# EAGLE design wt41_uart_breakout_board_v10 (EAGLE 5.11)
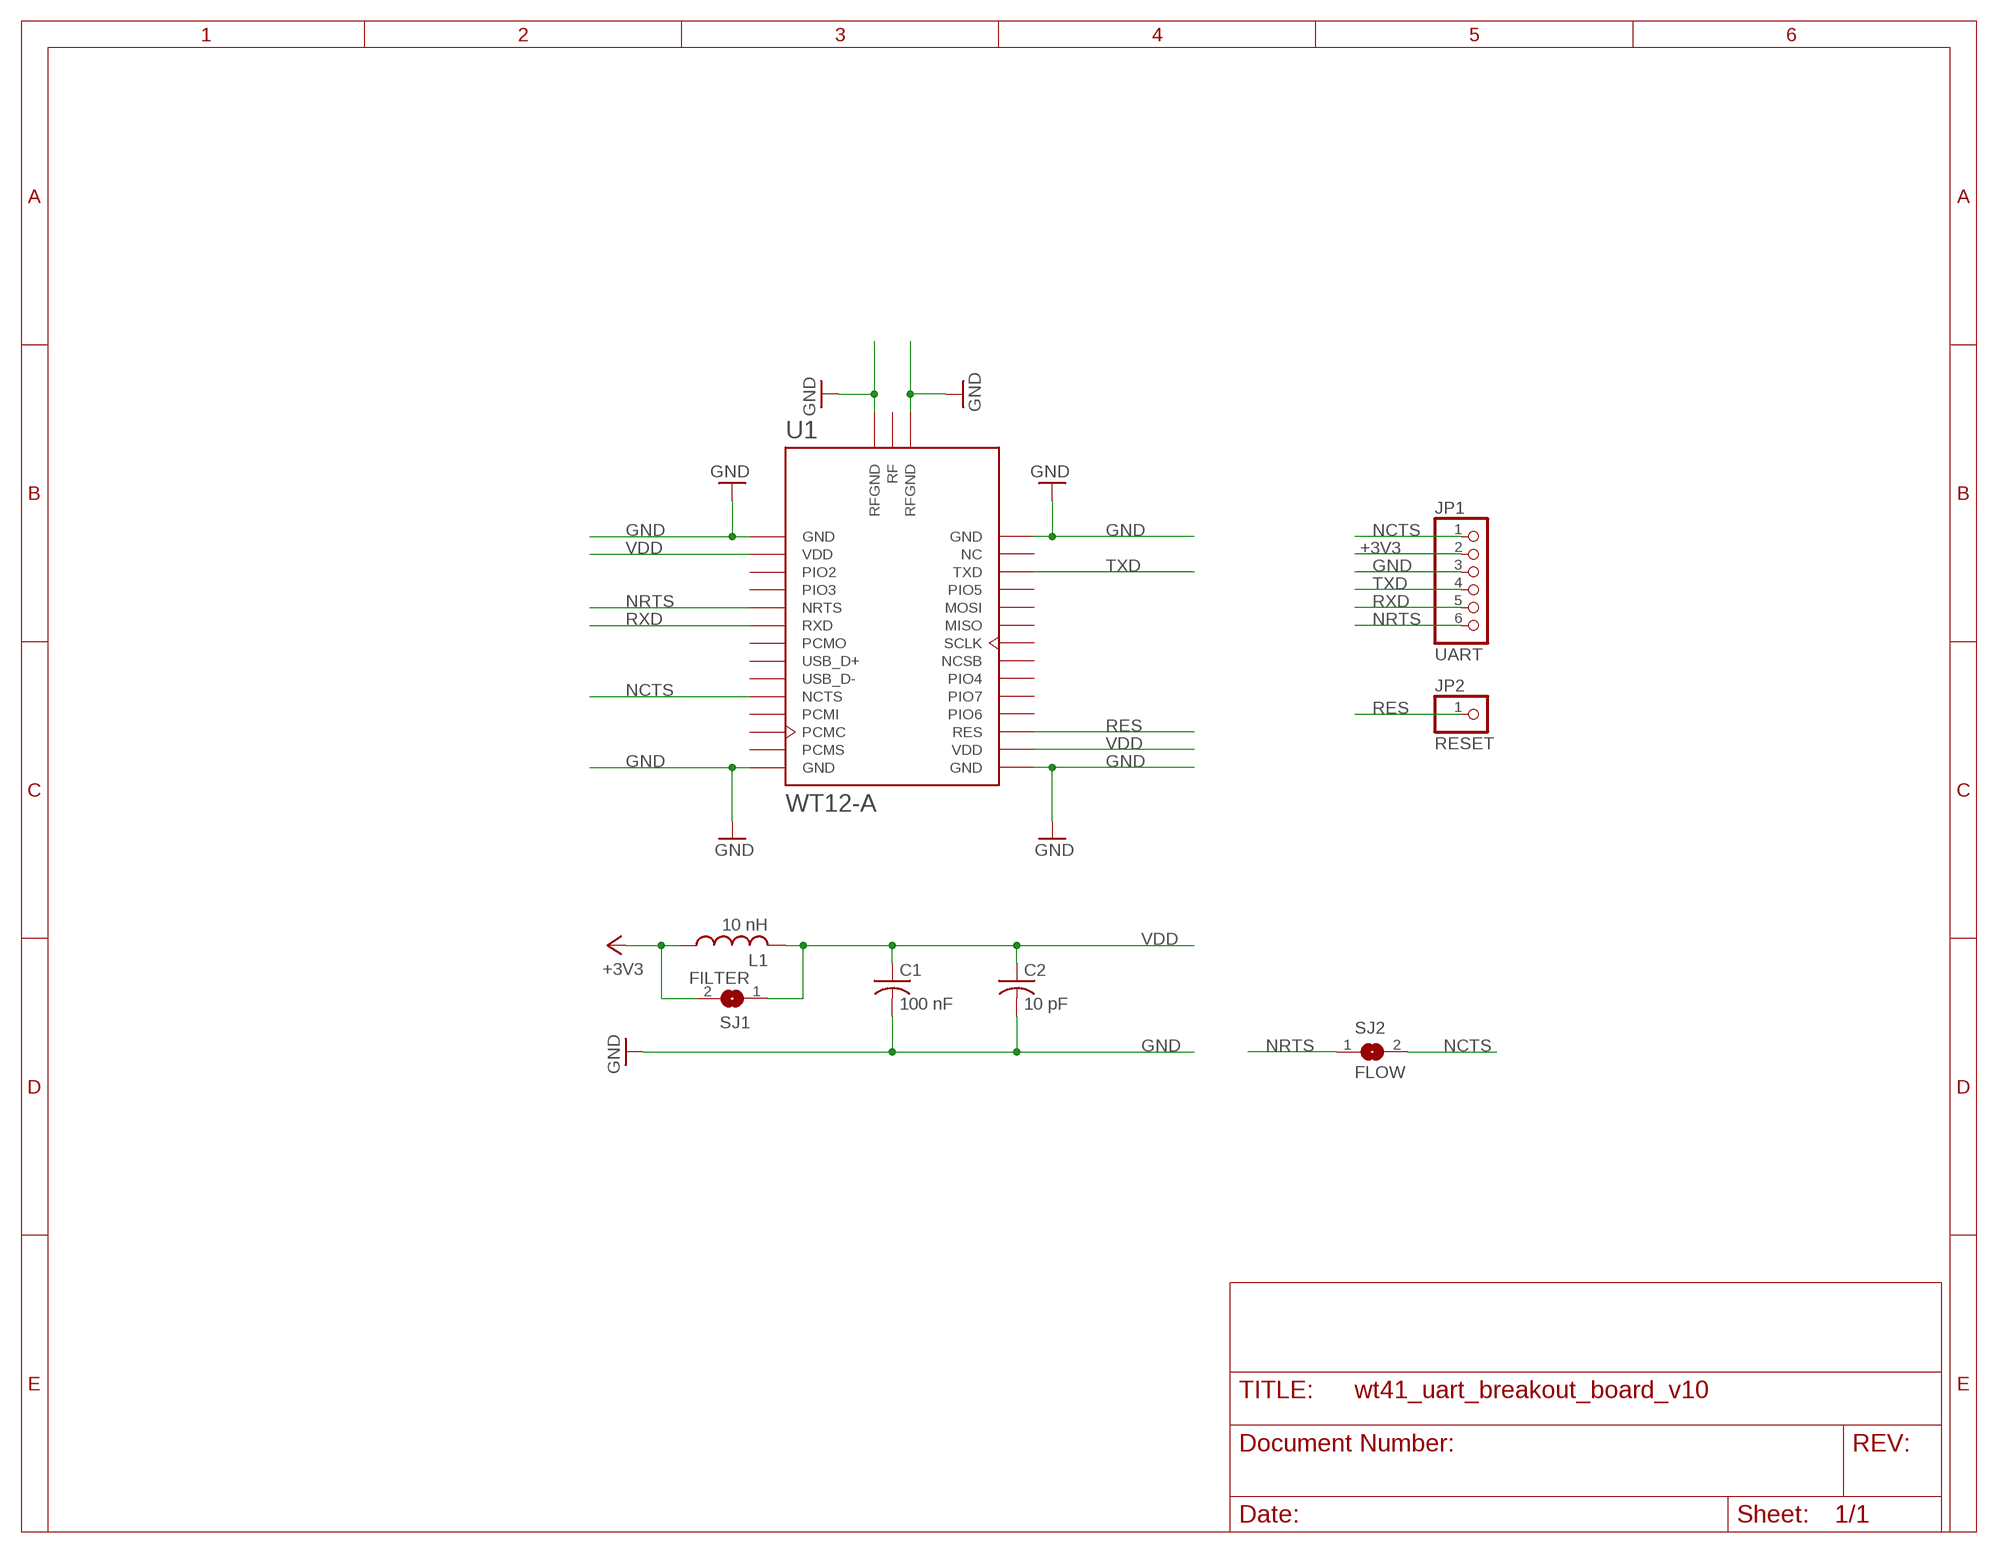
[diagram p0: schematic, sheet 1]

## Parts
C1  100 nF  C-US025-025X050  [C025-025X050]
C2  10 pF  C-US025-025X050  [C025-025X050]
JP1  UART  PINHD-1X6  [1X06]
JP2  RESET  PINHD-1X1  [1X01]
L1  10 nH  L-US0204/7  [0204/7]
SJ1  FILTER  SJ  [SJ]
SJ2  FLOW  SJ  [SJ]
U1  WT12-A  WT12-A-VISUAL  [WT12-A]

## Nets
+3V3: JP1.2 L1.1 SJ1.2
GND: C1.2 C2.2 JP1.3 U1.GND1(GND) U1.GND2(GND) U1.GND3(GND) U1.GND4(GND) U1.RFGND1(RFGND) U1.RFGND2(RFGND)
NCTS: JP1.1 SJ2.2 U1.NCTS
NRTS: JP1.6 SJ2.1 U1.NRTS
RES: JP2.1 U1.RES
RXD: JP1.5 U1.RXD
TXD: JP1.4 U1.TXD
VDD: C1.1 C2.1 L1.2 SJ1.1 U1.VDD1(VDD) U1.VDD2(VDD)
Unconnected: U1.MISO U1.MOSI U1.NC U1.NCSB U1.PCMC U1.PCMI U1.PCMO U1.PCMS U1.PIO2 U1.PIO3 U1.PIO4 U1.PIO5 U1.PIO6 U1.PIO7 U1.RF U1.SCLK U1.USB_D+ U1.USB_D-

## Library data of the parts
C1 C2 = resistor:C-US: CAPACITOR, American symbol
JP1 = sf-pinhead:PINHD-1X6: PIN HEADER
JP2 = sf-pinhead:PINHD-1X1: PIN HEADER
L1 = resistor:L-US: INDUCTOR, American symbol
SJ1 SJ2 = jumper:SJ: SMD solder JUMPER
U1 = sf-bluegiga:WT12-A-VISUAL: Class 2 Bluetooth 2.1 + EDR module, chip antenna and RF pins

## Net classes
0 default: width 0.254 mm, drill 0.508 mm, clearance 0.254 mm

## Board
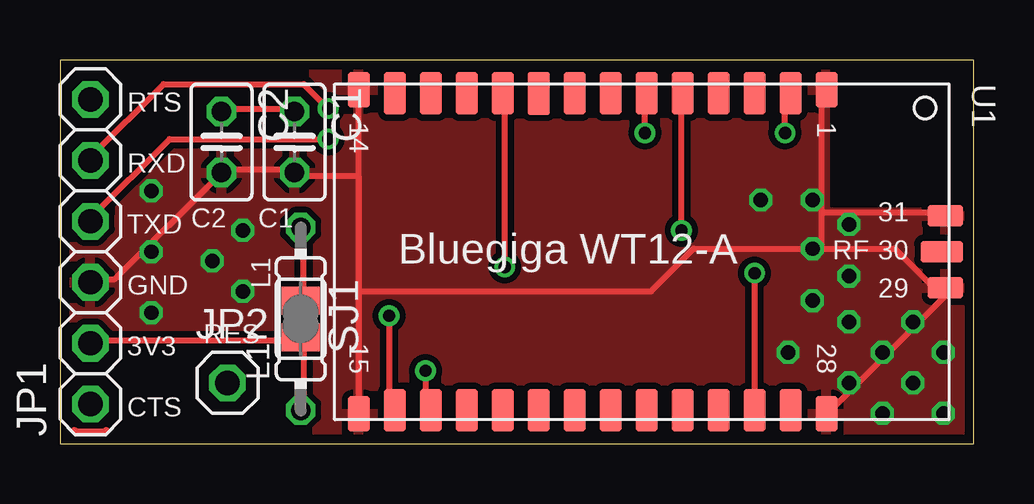
[diagram p1: board, top side]
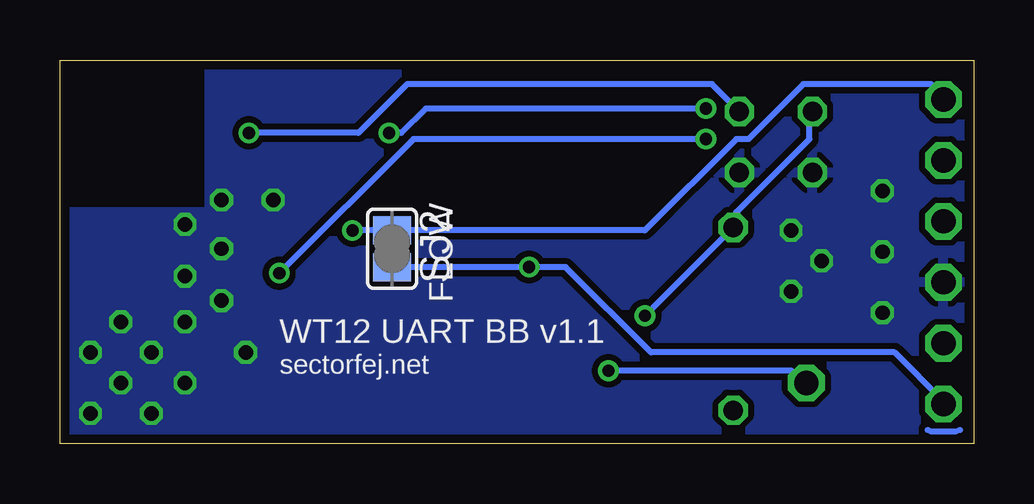
[diagram p2: board, bottom side, seen from below]

Size 38.1 x 15.99 mm. Coordinates in mm from the lower left corner, seen from the top.
Outline: 0,0 38.1,0 38.1,15.99 0,15.99 0,0
Copper layers (1*16): Top 0.0356mm / dielectric 1.5011mm / Bottom 0.0356mm
Design rules "LaenPCBOrder": minimum track width 6mil, minimum drill 13mil, track to track 6mil, track to pad 6mil, pad to pad 6mil, via to via 6mil, smd to smd 6mil, copper to edge 15mil, drill to drill 6mil, minimum pad ring 7mil, minimum via ring 7mil, stop-mask expansion 4mil, vias tented up to drill 0mil, thermal gap 10mil

### Footprints (pad centres in the part's own frame; a part is rotated, then mirrored left to right if it is on the bottom)
C025-025X050 = drill 0.813 octagon: 1 -1.27,0; 2 1.27,0
1X06 = drill 1.016 octagon: 1 -6.35,0; 2 -3.81,0; 3 -1.27,0; 4 1.27,0; 5 3.81,0; 6 6.35,0
1X01 = drill 1.016 octagon: 1 0,0
0204/7 = drill 0.813 octagon: 1 -3.81,0; 2 3.81,0
SJ = smd 1.168 x 1.6: 1 -0.762,0; 2 0.762,0
WT12-A = smd 1.478 x 0.914: GND1 -6.75,7.7; GND2 -6.75,-11.8; GND3 6.75,-11.8; GND4 6.75,7.7 | smd 1.778 x 0.914: MISO 6.6,0.2; MOSI 6.6,1.7; NC 6.6,6.2; NCSB 6.6,-2.8; NCTS -6.6,-5.8; NRTS -6.6,1.7; PCMC -6.6,-8.8; PCMI -6.6,-7.3; PCMO -6.6,-1.3; PCMS -6.6,-10.3; PIO2 -6.6,4.7; PIO3 -6.6,3.2; PIO4 6.6,-4.3; PIO5 6.6,3.2; PIO6 6.6,-7.3; PIO7 6.6,-5.8; RES 6.6,-8.8; RXD -6.6,0.2; SCLK 6.6,-1.3; TXD 6.6,4.7; USB_D+ -6.6,-2.8; USB_D- -6.6,-4.3; VDD1 -6.6,6.2; VDD2 6.6,-10.3 | smd 0.914 x 1.778: RF 0,12.5 | smd 0.914 x 1.478: RFGND1 1.5,12.65; RFGND2 -1.5,12.65

### Placement (x,y rotation side)
C1  9.78,12.57 270 top
C2  6.73,12.57 270 top
JP1  1.27,8 90 top
JP2  6.99,2.54 0 top
L1  10.03,5.21 90 top
SJ1  10.03,5.21 270 top
SJ2  24.26,8.13 270 bottom
U1  24.26,8 270 top

### Tracks (layer width: path | path; a pad name or v marks a point on that pad's centre or on a via)
+3V3
  Top 0.254: L1.1 10.16,1.52 10.16,4.32 SJ1.2 9.91,4.32 1.27,4.32 JP1.2
GND  (via drill 0.6)
  Top 0.254: U1.GND4 32,1.27 37.08,6.35 U1.RFGND1 36.83,6.6 36.32,6.6 34.8,8.13 31.75,8.13 | 31.75,9.65 31.75,14.73 U1.GND1 | 31.75,9.65 36.83,9.65 U1.RFGND2 | 31.75,8.13 31.75,9.65 | 12.45,11.18 12.45,14.73 U1.GND2 | 12.45,11.18 12.45,6.35 | 12.45,6.35 12.45,1.27 U1.GND3 | JP1.3 1.27,6.86 2.29,6.86 C2.2 6.86,11.43 9.65,11.43 C1.2 9.91,11.18 12.45,11.18 | 31.75,8.13 v31.37,8.13 26.42,8.13 24.64,6.35 12.45,6.35
  other vias: 3.81,10.54 3.81,8 3.81,5.46 7.62,8.89 6.35,7.62 7.62,6.35 29.21,10.16 31.37,10.16 32.89,9.14 32.89,6.99 31.37,5.97 32.89,5.08 30.35,3.81 32.89,2.54 34.29,3.81 35.56,5.08 36.83,3.81 35.56,2.54 34.29,1.27 36.83,1.27
  pour Top: 0,16 31.88,16 31.88,9.65 38.1,9.65 38.1,0 0,0
  pour Bottom: 0,16 31.88,16 31.88,9.65 38.1,9.65 38.1,0 0,0
GNDA
  Top 0.254: 0.58,0.58 0.76,0.51 1.78,0.51 1.93,0.58
GNDB
  Bottom 0.254: 1.93,0.58 1.78,0.51 0.76,0.51 0.58,0.58
NCTS  (via drill 0.51)
  Top 0.254: v18.54,7.37 18.54,14.48 U1.NCTS
  Bottom 0.254: SJ2.2 v18.54,7.37 17.02,7.37 13.46,3.81 3.3,3.81 1.27,1.78 JP1.1
NRTS  (via drill 0.51)
  Top 0.254: v25.91,8.89 25.91,14.48 U1.NRTS
  Bottom 0.254: JP1.6 1.27,14.48 1.78,14.99 7.11,14.99 9.4,12.7 9.91,12.7 13.72,8.89 SJ2.1 v25.91,8.89
RES  (via drill 0.51)
  Top 0.254: v15.24,3.05 15.24,1.52 U1.RES
  Bottom 0.254: v15.24,3.05 7.62,3.05 7.11,2.54 JP2.1
RXD  (via drill 0.51)
  Top 0.254: v24.38,12.95 24.38,14.48 U1.RXD | v11.18,13.97 10.16,14.99 4.32,14.99 1.27,11.94 JP1.5
  Bottom 0.254: v24.38,12.95 23.88,12.95 22.86,13.97 v11.18,13.97
TXD  (via drill 0.51)
  Top 0.254: v28.96,7.11 28.96,1.52 U1.TXD | v11.18,12.7 4.57,12.7 1.27,9.4 JP1.4
  Bottom 0.254: v28.96,7.11 23.37,12.7 v11.18,12.7
VDD  (via drill 0.51)
  Top 0.254: SJ1.1 10.16,6.1 10.16,8.89 L1.2 | v13.72,5.33 13.72,1.52 U1.VDD2 | v30.23,12.95 30.23,14.48 U1.VDD1 | C2.1 6.86,13.97 9.65,13.97 C1.1
  Bottom 0.254: v13.72,5.33 L1.2 9.91,9.14 9.91,9.65 6.86,12.7 6.86,13.72 C2.1 | v30.23,12.95 25.65,12.95 23.62,14.99 10.92,14.99 C1.1

### Text on the board
tPlace: RTS | RXD | TXD | C2 | C1 | Bluegiga WT12-A | GND | L1 | 3V3 | RES | CTS
bPlace: FLOW | WT12 UART BB v1.1 | sectorfej.net